# Altium project Senior_Design.PrjPcb
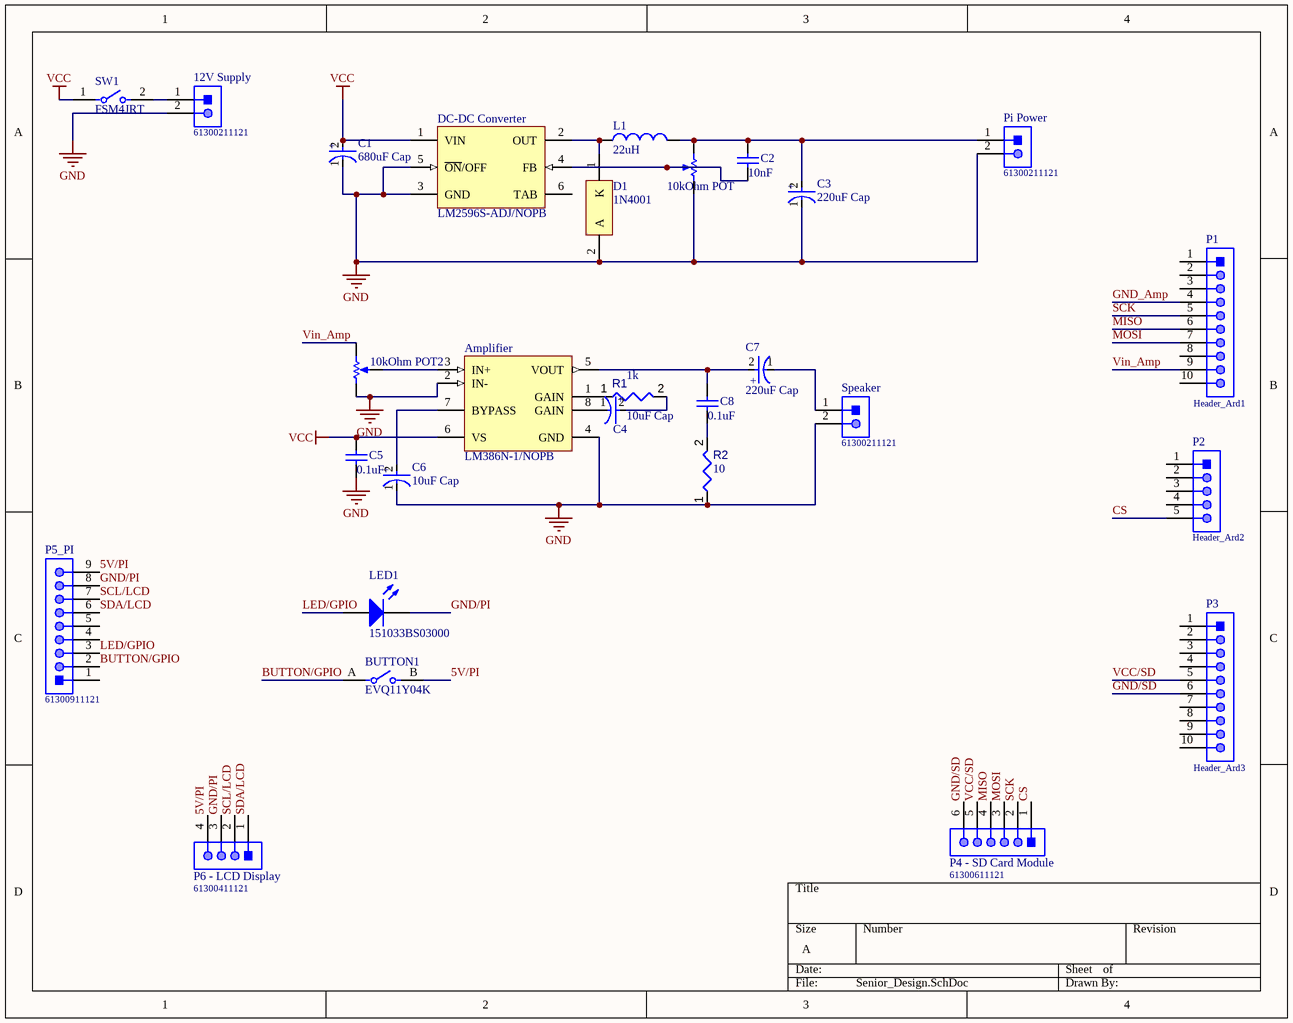
[diagram p0: Senior_Design.SchDoc]
1 sheet, 28 parts. Net scope: global (net labels, ports and power ports of the same name join across sheets).
Board file: Senior_DesignPCB.PcbDoc

## Sheet Senior_Design.SchDoc
size A; SheetNumber: 1; SheetTotal: 1

### Parts
10kOhm_POT  3362P-1-103LF  [BOUR-3362P]  (value not drawn)
10kOhm_POT2  3362P-1-103LF  [BOUR-3362P]  (value not drawn)
12V_Supply  61300211121  [61300211121]
Amplifier  LM386N-1/NOPB  [P0008A]
BUTTON1  EVQ11Y04K  [FP-EVQ11Y04K-MFG]
C1  680uF Cap  [FP-EEUFC1J681L-MFG]
C2  10nF  [KEMT-C330C105M5U5TA]
C3  220uF Cap  [FP-EEUFC1J681L-MFG]
C4  10uF Cap  [FP-EEUFC1J681L-MFG]
C5  0.1uF  [KEMT-C330C105M5U5TA]
C6  10uF Cap  [FP-EEUFC1J681L-MFG]
C7  220uF Cap  [FP-EEUFC1J681L-MFG]
C8  0.1uF  [KEMT-C330C105M5U5TA]
D1  1N4001  [ONSC-AXIAL_LEAD-2-59-10_P]
DC-DC_Converter  LM2596S-ADJ/NOPB  [KTT0005B_M]
L1  22uH  [CAPA81-2290X1140_V]
LED1  151033BS03000  [Type 3mm]
P1  Header_Ard1  [61301011121]
P2  Header_Ard2  [61300511121]
P3  Header_Ard3  [61301011121]
P4_-_SD_Card_Module  61300611121  [61300611121]
P5_PI  61300911121  [61300911121]
P6_-_LCD_Display  61300411121  [61300411121]
Pi_Power  61300211121  [61300211121]
R1  value 1k  [RESA60-630X240]  (hidden comment: MFR-25FBF52-1K)
R2  value 10  [RESA60-630X240]  (hidden comment: MFR-25FBF52-1K)
Speaker  61300211121  [61300211121]
SW1  FSM4JRT  [FP-FSM4JRT-MFG]

### Nets
GND: 10kOhm_POT.3(CW) 10kOhm_POT2.1(CCW) 12V_Supply.2 Amplifier.2(IN-) Amplifier.4(GND) C1.1(C) C3.1(C) C5.1 C6.1(C) D1.2(A) DC-DC_Converter.3(GND) DC-DC_Converter.5(~{ON}/OFF) Pi_Power.2 R2.1 Speaker.2
VCC: Amplifier.6(VS) C1.2(A) C5.2 DC-DC_Converter.1(VIN) SW1.1
5V/PI: BUTTON1.B P5_PI.9 P6_-_LCD_Display.4
BUTTON/GPIO: BUTTON1.A P5_PI.2
CS: P2.5 P4_-_SD_Card_Module.1
GND/PI: LED1.1(K) P5_PI.8 P6_-_LCD_Display.3
GND/SD: P3.6 P4_-_SD_Card_Module.6
GND_Amp: P1.4
LED/GPIO: LED1.2(A) P5_PI.3
MISO: P1.6 P4_-_SD_Card_Module.4
MOSI: P1.7 P4_-_SD_Card_Module.3
SCK: P1.5 P4_-_SD_Card_Module.2
SCL/LCD: P5_PI.7 P6_-_LCD_Display.2
SDA/LCD: P5_PI.6 P6_-_LCD_Display.1
VCC/SD: P3.5 P4_-_SD_Card_Module.5
Vin_Amp: 10kOhm_POT2.3(CW) P1.9
Net10kOhm_POT2_2: 10kOhm_POT2.2(S) Amplifier.3(IN+)
Net10kOhm_POT_1: 10kOhm_POT.1(CCW) C2.2 C3.2(A) L1.2 Pi_Power.1
Net10kOhm_POT_2: 10kOhm_POT.2(S) C2.1 DC-DC_Converter.4(FB)
Net12V_Supply_1: 12V_Supply.1 SW1.2
NetAmplifier_1: Amplifier.1(GAIN) R1.1
NetAmplifier_5: Amplifier.5(VOUT) C7.2(A) C8.2
NetAmplifier_7: Amplifier.7(BYPASS) C6.2(A)
NetAmplifier_8: Amplifier.8(GAIN) C4.1(C)
NetC4_2: C4.2(A) R1.2
NetC7_1: C7.1(C) Speaker.1
NetC8_1: C8.1 R2.2
NetD1_1: D1.1(K) DC-DC_Converter.2(OUT) L1.1

Not connected (* = marked no-connect by the designer): DC-DC_Converter 6(TAB); P1 1 2 3 8 10; P2 1 2 3 4; P3 1 2 3 4 7 8 9 10; P5_PI 1 4 5

### Notes on the sheet
- (in symbol CMP-05427-000007-1) +

### Library data of the parts
10kOhm_POT 10kOhm_POT2 = CMP-009-00039-1: Square Trimpot(R) Trimming Potentiometer, 10 KOhm, 300 V, -55 to 125 degC, 3-Pin THD, RoHS, Tube; Manufacturer: Bourns; Resistance: 10k; Voltage Rating: 300V; Power: 500mW; Tolerance: 10%; Manufacturer URL: http://www.bourns.com/; Pins: 3; Package Quantity: 250; Composition: Potentiometer; Case/Package: 3326P; Package Reference: 3326P; RoHS Compliant: True; Datasheet URL: http://www.bourns.com/docs/Product-Datasheets/3362.pdf; Lead Pitch: 2.54mm; Mounting Technology: TH; Max Operating Temperature: 125°C; Package Description: 3-Pin Through Hole Device, Body 6.6 x 6.99 mm, Pitch 2.54 mm; Packaging: Rail/Tube; Datasheet Version: May-16; Min Operating Temperature: -55°C
12V_Supply Pi_Power Speaker = CMP-1712-00002-4: THT Vertical Pin Header WR-PHD, Pitch 2.54 mm, Single Row, 2 pins; Manufacturer: Wurth Elektronik; Rated Current: 3A; Gender: Male; Withstanding Voltage: 500VAC; Working Voltage: 250VAC; Pitch: 2.54mm; Contact Resistance: 20mOhm; Pin Number: 2; Mounting Technology: THT; Orientation: Vertical; Operating Temperature: -40to105degC; Packaging: Bag; Publisher: WurthElektronik; Datasheet URL: https://katalog.we-online.de/em/datasheet/6130xx11121.pdf; Manufacturer URL: http://www.we-online.de; Row Number: Single; Package Reference: 61300211121; Part Number: 61300211121
Amplifier = CMP-0057-00052-4: Low Voltage Audio Power Amplifier, 8-pin MDIP, Pb-Free; Manufacturer: Texas Instruments; PackageTopMarking: NSUZXYTTE#*LM*386N-1; PowerWise: N; CompType: Audio IC; RoHS: Y; PackageReference: P0008A; Code_JEDEC: MS-001-BA; PackageDescription: MDIP, .365 x .250 x .130in, 8 Lead, .100in Pitch; PinCount: 8; ComponentLink1URL: http://www.ti.com/general/docs/lit/getliterature.tsp?genericPartNumber=LM386&fileType=pdf; ComponentLink1Description: Datasheet URL
BUTTON1 = CMP-05618-000106-1: SWITCH TACTILE SPST-NO 0.02A 15V; Operating Force: 1.6N; Actuator Type: Standard; Actuator Length: 0.4mm; Actuator Color: Black; Mechanical Life: 1000000Cycles; Switch Function: Off-Mom; Contact Resistance: 50mR; Switch Travel: 0.25mm; Throw Configuration: SPST; Illumination Type: Non-Illuminated; Package Quantity: 1; Max Operating Temperature: 70°C; Case/Package: Radial; Radiation Hardening: No; Packaging: Tape and Reel; Termination: PC Pin; Orientation: Straight; Min Operating Temperature: -20°C; Lead Free: Lead Free; Electrical Life: 1000000Cycles; RoHS Compliant: Yes; Max Voltage Rating (DC): 15V; Mount: Through Hole; Series: EVQ11; Size: 6mm
C1 C3 C4 C6 C7 = CMP-05427-000007-1: CAP ALUM 680UF 20% 63V RADIAL; Manufacturer: Panasonic; Manufacturer Part Number: EEUFC1J681L; Ripple Current: 2265mA; Material: Aluminum; Life: 5000Hours; Automotive Grade: Grade 2; Leakage Current: 428.4uA; Dissipation Factor: 8%; ComponentLink2Description: Datasheet; ComponentLink2URL: https://industrial.panasonic.com/cdbs/www-data/pdf/RDF0000/ABA0000C1209.pdf; Temperature: -55°C to +105°C; Ipc Land Pattern Name: CAPRD500W100D1300H3700; Octopart: https://octopart.com/eeu-fc1j681l-panasonic-39478579; Tolerance: 20%; Voltage Rating: 63V; Category: Cap; Device Class L3: Aluminum Electrolytic Capacitors; Device Class L1: Passive Components; Package: 0; Value: 680uF; Mouser Description: Aluminum Electrolytic Capacitors - Leaded 680uF 63V; Height: 37mm; Automotive: Yes; Digikey Description: CAP ALUM 680UF 20% 63V RADIAL; Device Class L2: Capacitors; Temperature Range High: +105°C; Temperature Range Low: -55°C; RoHS: TRUE; Lead Free: Yes; Capacitance: 680uF
C2 C5 C8 = CMP-2000-06056-1: Ceramic Capacitor, 1 uF, +/- 20%, 50 V, -10 to 85 degC, 2-Pin THD, RoHS, Bulk; Manufacturer: Kemet; Voltage - Rated: 50V; Temperature Coefficient: Z5U; Catalog Drawings: C330(std); Product Training Modules: CapacitorBasics-TypicalUsesforCapacitors; Capacitance: 1µF; Online Catalog: GoldenMax™Series; Other Names: 399-4390; PCN Design/Specification: C3yySeriesGoldenMaxLeadConfiguration02/Feb/2015; Thickness (Max): -; Size / Dimension: 0.300"Lx0.150"W(7.62mmx3.81mm); Mounting Technology: ThroughHole; Tolerance: ±20%; Mounting Type: ThroughHole; Datasheet URL: http://www.kemet.com/Lists/ProductCatalog/Attachments/599/KEM_C1051_GOLDMAX_Z5U.pdf; Series: GoldenMax™; Standard Package: 250; Ratings: -; Applications: GeneralPurpose; Package Reference: C330C105M5U5TA; Packaging: Bulk; Category: Capacitors; Package Description: 2-Pin Through Hole Device, Body 7.11 x 4.07 mm; Operating Temperature: 10°C~85°C; Height - Seated (Max): 0.360"(9.14mm); Manufacturer URL: http://www.kemet.com/; Lead Spacing: 0.200"(5.08mm); Features: -; Lead Style: Straight; Package / Case: Radial; Family: CeramicCapacitors; Datasheet Version: 12/2015
D1 = CMP-0902-00117-1: Standard Recovery Rectifier, 2-Pin Axial_Lead, Pb-Free, Bulk Bag; Manufacturer: On Semiconductor; VRRM Max (V): 50; IFSM Max (A): 30; IO(rec) Max (A): 1; ComponentLink3URL: http://www.onsemi.cn/pub_link/Collateral/59-10.PDF; ComponentLink3Description: Package Specification; PartNumber: 1N4001; PackageVersion: Rev. U, 02/2005; Packing: Bulk Bag; ComponentLink2Description: Datasheet; RoHS: TRUE; DatasheetVersion: Rev. 13; PackageReference: AXIAL_LEAD-2-59-10; ComponentLink1URL: http://www.onsemi.com/; Mounting Technology: Through Hole; PackageDescription: 2-Pin, Axial Lead, Diameter 2.35 mm; ComponentLink2URL: http://www.onsemi.com/pub_link/Collateral/1N4001-D.PDF; Type: Standard Recovery; ComponentLink1Description: Manufacturer URL
DC-DC_Converter = CMP-0069-00271-3: SIMPLE SWITCHER® Power Converter 150 KHz 3A Step-Down Voltage Regulator, 5-pin TO-263, Pb-Free; Manufacturer: Texas Instruments; PowerWise: N; PackageTopMarking: NSUZXYTTE#*LM2596S*-ADJ P+; ComponentLink1Description: Datasheet URL; PackageDescription: TO-263, Molded, .400 x .390 x .180in, 5 Lead, .067in Pitch, Surface Mount; ComponentLink1URL: http://www.ti.com/general/docs/lit/getliterature.tsp?genericPartNumber=LM2596&fileType=pdf; Code_JEDEC: MO-169-AB; PinCount: 5; CompType: Switcher; PackageReference: KTT0005B; RoHS: Y
L1 = CMP-2000-05083-1: Axial Power Inductor, 22 uH, +/- 10%, -55 to 125 degC, 2-Pin THD, RoHS, Bulk; Manufacturer: Abracon; Type: Wirewound; Inductance: 22µH; Current Rating: 6.07A; DC Resistance (DCR): 26mOhmMax; Frequency - Test: 1kHz; Shielding: Unshielded; Frequency - Self Resonant: -; Series: AIAP-03; Package Reference: CAPA81-2290X1140; Ratings: -; Q @ Freq: -; Package Description: 2-Pin Axial Lead, Dia 11.4 mm, Body Length 22.9 mm; Operating Temperature: -55degC~125degC; Datasheet URL: http://datasheet.octopart.com/AIAP-03-220K-Abracon-datasheet-38892904.pdf; Family: FixedInductors; Mounting Type: ThroughHole; Datasheet Version: Jan-12; Current - Saturation: -; Packaging: Bulk; Category: Inductors,Coils,Chokes; Size / Dimension: 0.450"Diax0.900"L(11.40mmx22.90mm); Material - Core: -; Tolerance: ±10%; Manufacturer URL: http://www.abracon.com/; Package / Case: Axial; Height - Seated (Max): -
LED1 = CMP-1489-00002-1: THT LED round mono-color waterclear, WL-TMRW , Blue; Manufacturer: Wuerth Elektronik; ComponentLink2URL: http://katalog.we-online.de/pbs/datasheet/7448042001.pdfhttp://katalog.we-online.de/pbs/datasheet/7448042001.pdfhttp://katalog.we-online.de/pbs/datasheet/7448042001.pdfhttp://katalog.we-online.de/pbs/datasheet/151033BS03000.pdf; ComponentLink1Description: Manufacturer URL; Emitting color: Blue; PackageReference: Type 3mm; ComponentLink2Description: Datasheet; PartNumber: 151033BS03000; ComponentLink1URL: http://www.we-online.com
P1 P3 = CMP-1502-01082-1: THT Vertical Pin Header WR-PHD, Pitch 2.54 mm, Single Row, 10 pins; Manufacturer: Wurth Elektronik; Contact Resistance: 20mOhm; Rated Current: 3A; Pitch: 2.54mm; Gender: Male; Pin Number: 10; Working Voltage: 250VAC; Withstanding Voltage: 500VAC; Manufacturer URL: http://www.we-online.de; Operating Temperature: -40to105degC; Datasheet URL: https://katalog.we-online.de/em/datasheet/6130xx11121.pdf; Row Number: Single; Orientation: Vertical; Part Number: 61301011121; Packaging: Bag; Package Reference: 61301011121; Mounting Technology: THT; Publisher: WurthElektronik
P2 = CMP-1502-01068-1: THT Vertical Pin Header WR-PHD, Pitch 2.54 mm, Single Row, 5 pins; Manufacturer: Wurth Elektronik; Pin Number: 5; Contact Resistance: 20mOhm; Working Voltage: 250VAC; Pitch: 2.54mm; Withstanding Voltage: 500VAC; Rated Current: 3A; Gender: Male; Datasheet URL: https://katalog.we-online.de/em/datasheet/6130xx11121.pdf; Orientation: Vertical; Mounting Technology: THT; Row Number: Single; Package Reference: 61300511121; Publisher: WurthElektronik; Part Number: 61300511121; Packaging: Bag; Manufacturer URL: http://www.we-online.de; Operating Temperature: -40to105degC
P4_-_SD_Card_Module = CMP-1502-01070-1: THT Vertical Pin Header WR-PHD, Pitch 2.54 mm, Single Row, 6 pins; Manufacturer: Wurth Elektronik; Gender: Male; Pin Number: 6; Pitch: 2.54mm; Working Voltage: 250VAC; Rated Current: 3A; Withstanding Voltage: 500VAC; Contact Resistance: 20mOhm; Operating Temperature: -40to105degC; Packaging: Bag; Datasheet URL: https://katalog.we-online.de/em/datasheet/6130xx11121.pdf; Package Reference: 61300611121; Mounting Technology: THT; Publisher: WurthElektronik; Part Number: 61300611121; Manufacturer URL: http://www.we-online.de; Row Number: Single; Orientation: Vertical
P5_PI = CMP-1502-01080-1: THT Vertical Pin Header WR-PHD, Pitch 2.54 mm, Single Row, 9 pins; Manufacturer: Wurth Elektronik; Pitch: 2.54mm; Gender: Male; Working Voltage: 250VAC; Contact Resistance: 20mOhm; Withstanding Voltage: 500VAC; Pin Number: 9; Rated Current: 3A; Package Reference: 61300911121; Part Number: 61300911121; Mounting Technology: THT; Publisher: WurthElektronik; Manufacturer URL: http://www.we-online.de; Orientation: Vertical; Datasheet URL: https://katalog.we-online.de/em/datasheet/6130xx11121.pdf; Operating Temperature: -40to105degC; Row Number: Single; Packaging: Bag
P6_-_LCD_Display = CMP-1502-01064-1: THT Vertical Pin Header WR-PHD, Pitch 2.54 mm, Single Row, 4 pins; Manufacturer: Wurth Elektronik; Withstanding Voltage: 500VAC; Rated Current: 3A; Working Voltage: 250VAC; Pin Number: 4; Gender: Male; Contact Resistance: 20mOhm; Pitch: 2.54mm; Manufacturer URL: http://www.we-online.de; Operating Temperature: -40to105degC; Packaging: Bag; Mounting Technology: THT; Package Reference: 61300411121; Datasheet URL: https://katalog.we-online.de/em/datasheet/6130xx11121.pdf; Publisher: WurthElektronik; Part Number: 61300411121; Row Number: Single; Orientation: Vertical
R1 R2 = CMP-009-00048-3: Axial Resistor, 1 KOhm, +/- 1%, 250 mW, -55 to 155 degC, 2-Pin THD, RoHS, Bulk; Manufacturer: Yageo; Voltage Rating: 250V; Power: 250mW; RoHS Compliant: True; Manufacturer URL: http://www.yageo.com/; Package Description: 2-Pin Axial Lead, Dia 2.4 mm, Body Length 6.3 mm; Datasheet URL: http://www.yageo.com/documents/recent/Yageo%20LR_MFR_2013.pdf; Tolerance: 1%; Package Quantity: 200; Min Operating Temperature: -55°C; Package Reference: MFR-25; Case/Package: Axial; Mounting Technology: TH; Max Operating Temperature: 155°C; Composition: CarbonFilm; Datasheet Version: Apr-13; Packaging: Bulk
SW1 = CMP-03407-000038-1: SWITCH TACTILE SPST-NO 0.05A 24V; Current Rating: 50mA; Actuator Diameter: 3.5mm; Max Voltage Rating (DC): 12V; Actuator Length: 0.055inch; Switch Travel: 0.25mm; Actuator Type: Standard; Contact Resistance: 100mR; Illumination Type: Non-Illuminated; Electrical Life: 100000Cycles; Throw Configuration: SPST; Switch Function: Off-Mom; Actuator Material: Resin; Operating Force: 1.57N; Series: FSMJRT; Min Operating Temperature: -35°C; Max Current Rating: 50mA; Termination: PC Pins; Type: Switch; Radiation Hardening: No; Max Operating Temperature: 105°C; Voltage Rating (DC): 12V; Contact Material: Copper Alloy; Contact Current Rating: 50mA; RoHS Compliant: Yes; Mechanical Life: 100000Cycles; Mount: Through Hole; Package Quantity: 10000; Case/Package: Radial; Packaging: Tape and Reel; Length: 6.19mm; Contact Plating: Silver; Depth: 6.19mm; Orientation: Straight